# EAGLE design RotaryEncoder_ArduinoAdapter (EAGLE 6.5.0)
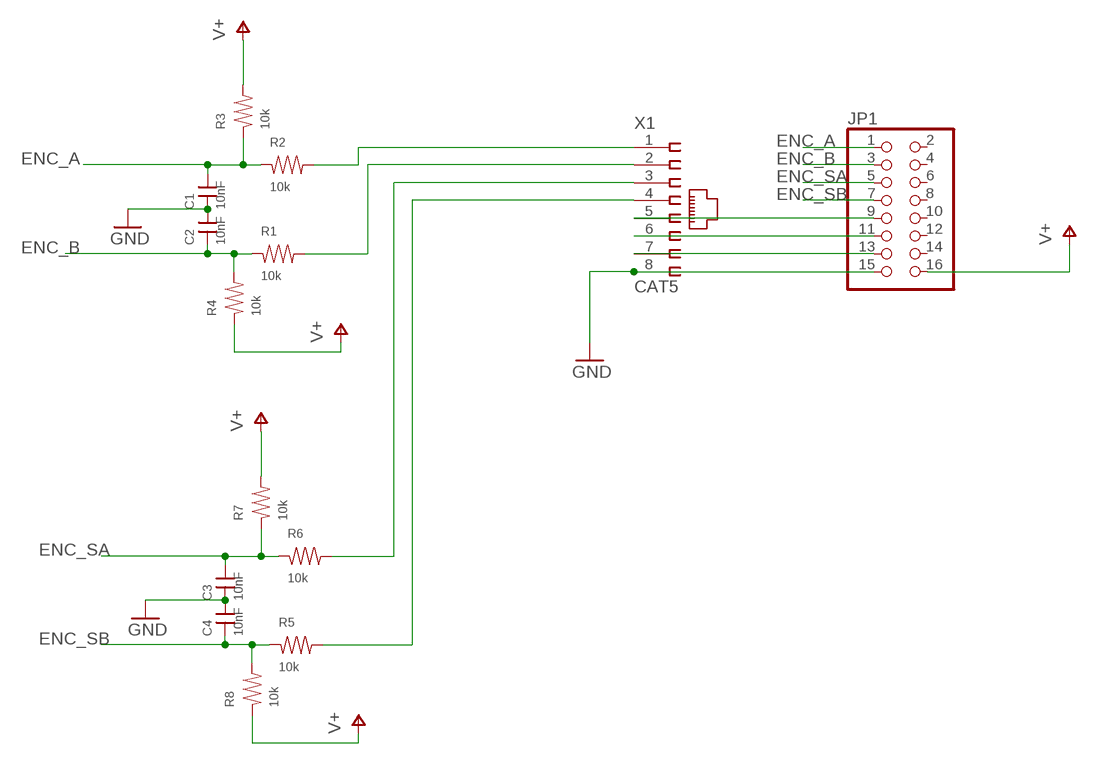
[diagram p0: schematic, sheet 1]

## Parts
C1  10nF  CAP0603  [0603]
C2  10nF  CAP0603  [0603]
C3  10nF  CAP0603  [0603]
C4  10nF  CAP0603  [0603]
JP1  PINHD-2X8  [2X08]
R1  10k  RES0603  [0603]
R2  10k  RES0603  [0603]
R3  10k  RES0603  [0603]
R4  10k  RES0603  [0603]
R5  10k  RES0603  [0603]
R6  10k  RES0603  [0603]
R7  10k  RES0603  [0603]
R8  10k  RES0603  [0603]
X1  CAT5  [555164-1]

## Nets
ENC_A: C1.2 JP1.1 R2.1 R3.1
ENC_B: C2.1 JP1.3 R1.1 R4.2
ENC_SA: C3.2 JP1.5 R6.1 R7.1
ENC_SB: C4.1 JP1.7 R5.1 R8.2
GND: C1.1 C2.2 C3.1 C4.2 JP1.15 X1.8
N$1: R5.2 X1.4
N$2: R6.2 X1.3
N$3: JP1.9 X1.5
N$4: R1.2 X1.2
N$5: R2.2 X1.1
N$6: JP1.11 X1.6
N$7: JP1.13 X1.7
V+: JP1.16 R3.2 R4.1 R7.2 R8.1
Unconnected: JP1.2 JP1.4 JP1.6 JP1.8 JP1.10 JP1.12 JP1.14

## Library data of the parts
C1-C4 = rlc-jqi:CAP: SMT Capacitor
JP1 = pinhead:PINHD-2X8: PIN HEADER
R1-R8 = rlc-jqi:RES: SMT Resistor
X1 = connector-jqi:CAT5: Standard CAT-5 Ethernet jack.; DIGIKEY: A31442-ND

## Board
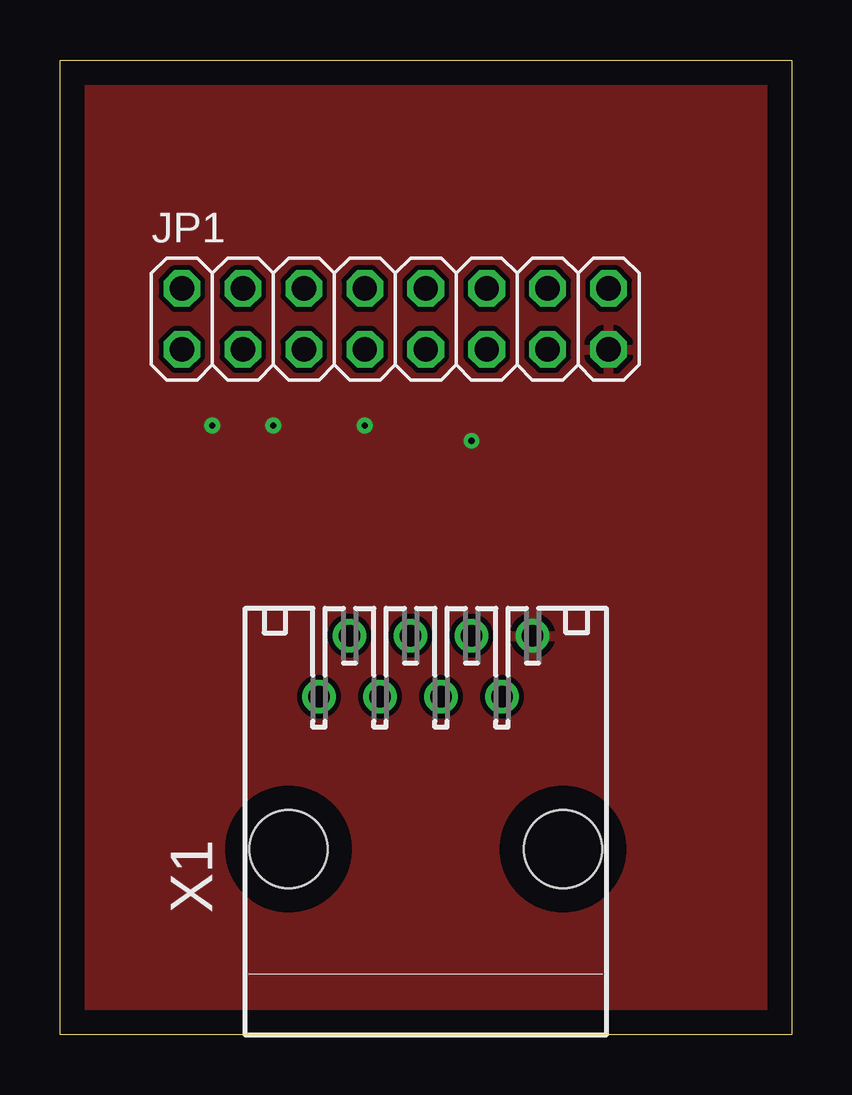
[diagram p1: board, top side]
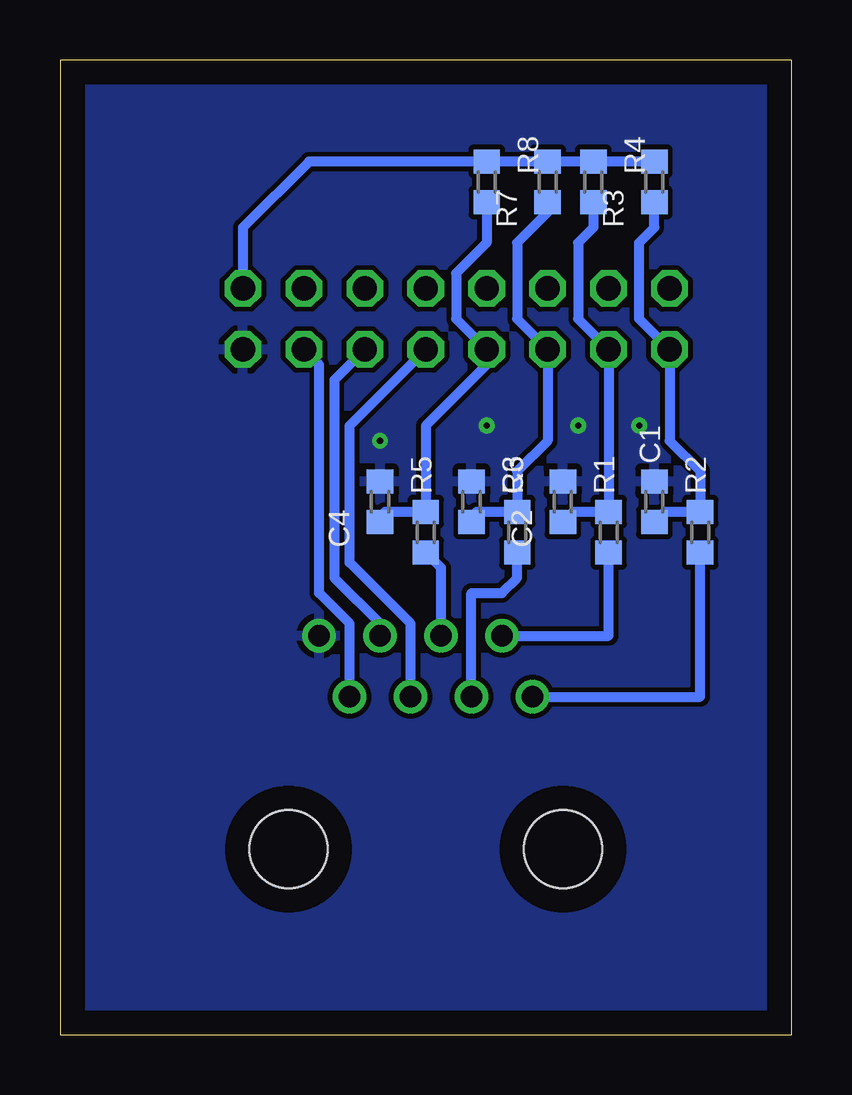
[diagram p2: board, bottom side, seen from below]

Size 30.48 x 40.64 mm. Coordinates in mm from the lower left corner, seen from the top.
Outline: 0,40.64 30.48,40.64 30.48,0 0,0 0,40.64
Copper layers (1*16): Top 0.035mm / dielectric 1.5mm / Bottom 0.035mm
Design rules "default": minimum track width 10mil, minimum drill 24mil, track to track 8mil, track to pad 8mil, pad to pad 8mil, via to via 8mil, smd to smd 8mil, copper to edge 40mil, drill to drill 8mil, minimum pad ring 10mil, minimum via ring 8mil, stop-mask expansion 4mil, vias tented up to drill 0mil, thermal gap 10mil

### Footprints (pad centres in the part's own frame; a part is rotated, then mirrored left to right if it is on the bottom)
0603 = smd 1 x 1.1: 1 -0.85,0; 2 0.85,0
2X08 = drill 1.016 octagon: 1 -8.89,-1.27; 2 -8.89,1.27; 3 -6.35,-1.27; 4 -6.35,1.27; 5 -3.81,-1.27; 6 -3.81,1.27; 7 -1.27,-1.27; 8 -1.27,1.27; 9 1.27,-1.27; 10 1.27,1.27; 11 3.81,-1.27; 12 3.81,1.27; 13 6.35,-1.27; 14 6.35,1.27; 15 8.89,-1.27; 16 8.89,1.27
555164-1 = drill 0.889: 1 -4.445,6.477; 2 -3.175,9.017; 3 -1.905,6.477; 4 -0.635,9.017; 5 0.635,6.477; 6 1.905,9.017; 7 3.175,6.477; 8 4.445,9.017 | hole 3.251: -5.715,0.127; 5.715,0.127

### Placement (x,y rotation side)
C1  5.71,22.23 270 bottom
C2  9.52,22.23 90 bottom
C3  13.34,22.23 270 bottom
C4  17.15,22.23 90 bottom
JP1  13.97,29.84 0 top
R1  7.62,20.95 270 bottom
R2  3.81,20.95 270 bottom
R3  5.71,35.56 90 bottom
R4  8.26,35.56 270 bottom
R5  15.24,20.95 270 bottom
R6  11.43,20.95 270 bottom
R7  10.16,35.56 90 bottom
R8  12.7,35.56 270 bottom
X1  15.24,7.62 0 top

### Tracks (layer width: path | path; a pad name or v marks a point on that pad's centre or on a via)
ENC_A
  Bottom 0.406: R3.1 5.71,33.66 6.35,33.02 6.35,29.84 JP1.1 5.08,24.77 3.81,23.5 R2.1 5.29,21.8 C1.2
ENC_B
  Bottom 0.406: R4.2 8.26,33.66 8.89,33.02 8.89,29.84 JP1.3 R1.1 9.09,21.8 C2.1
ENC_SA
  Bottom 0.406: R7.1 10.16,34.29 11.43,33.02 11.43,29.84 JP1.5 10.16,24.77 11.43,23.5 R6.1 13.13,21.8 C3.2
ENC_SB
  Bottom 0.406: R8.2 12.7,33.02 13.97,31.75 13.97,29.84 JP1.7 12.7,27.94 15.24,25.4 R5.1 16.94,21.8 C4.1
GND  (via drill 0.25)
  other vias: 6.35,25.4 8.89,25.4 12.7,25.4 17.15,24.77
  pour Bottom: 0,40.64 30.48,40.64 30.48,0 0,0
  pour Top: 0,40.64 30.48,40.64 30.48,0 0,0
N$1
  Bottom 0.406: X1.4 14.61,19.47 R5.2
N$2
  Bottom 0.406: X1.3 13.34,18.41 12.07,18.41 11.43,19.05 R6.2
N$3
  Bottom 0.406: X1.5 15.88,17.14 18.41,19.68 18.41,25.4 JP1.9
N$4
  Bottom 0.406: X1.2 7.62,16.64 R1.2
N$5
  Bottom 0.406: X1.1 3.81,14.1 R2.2
N$6
  Bottom 0.406: 17.27,16.64 X1.6 17.15,17.14 19.05,19.05 19.05,27.3 JP1.11
N$7
  Bottom 0.406: X1.7 18.41,17.14 19.69,18.41 19.69,27.94 JP1.13
V+
  Bottom 0.406: R3.2 R4.1 R7.2 R8.1 20.11,36.41 22.86,33.66 JP1.16